# Altium schematic sheet Smart Smoke Detector.SchDoc
size A3; SheetNumber: 1; SheetTotal: 2
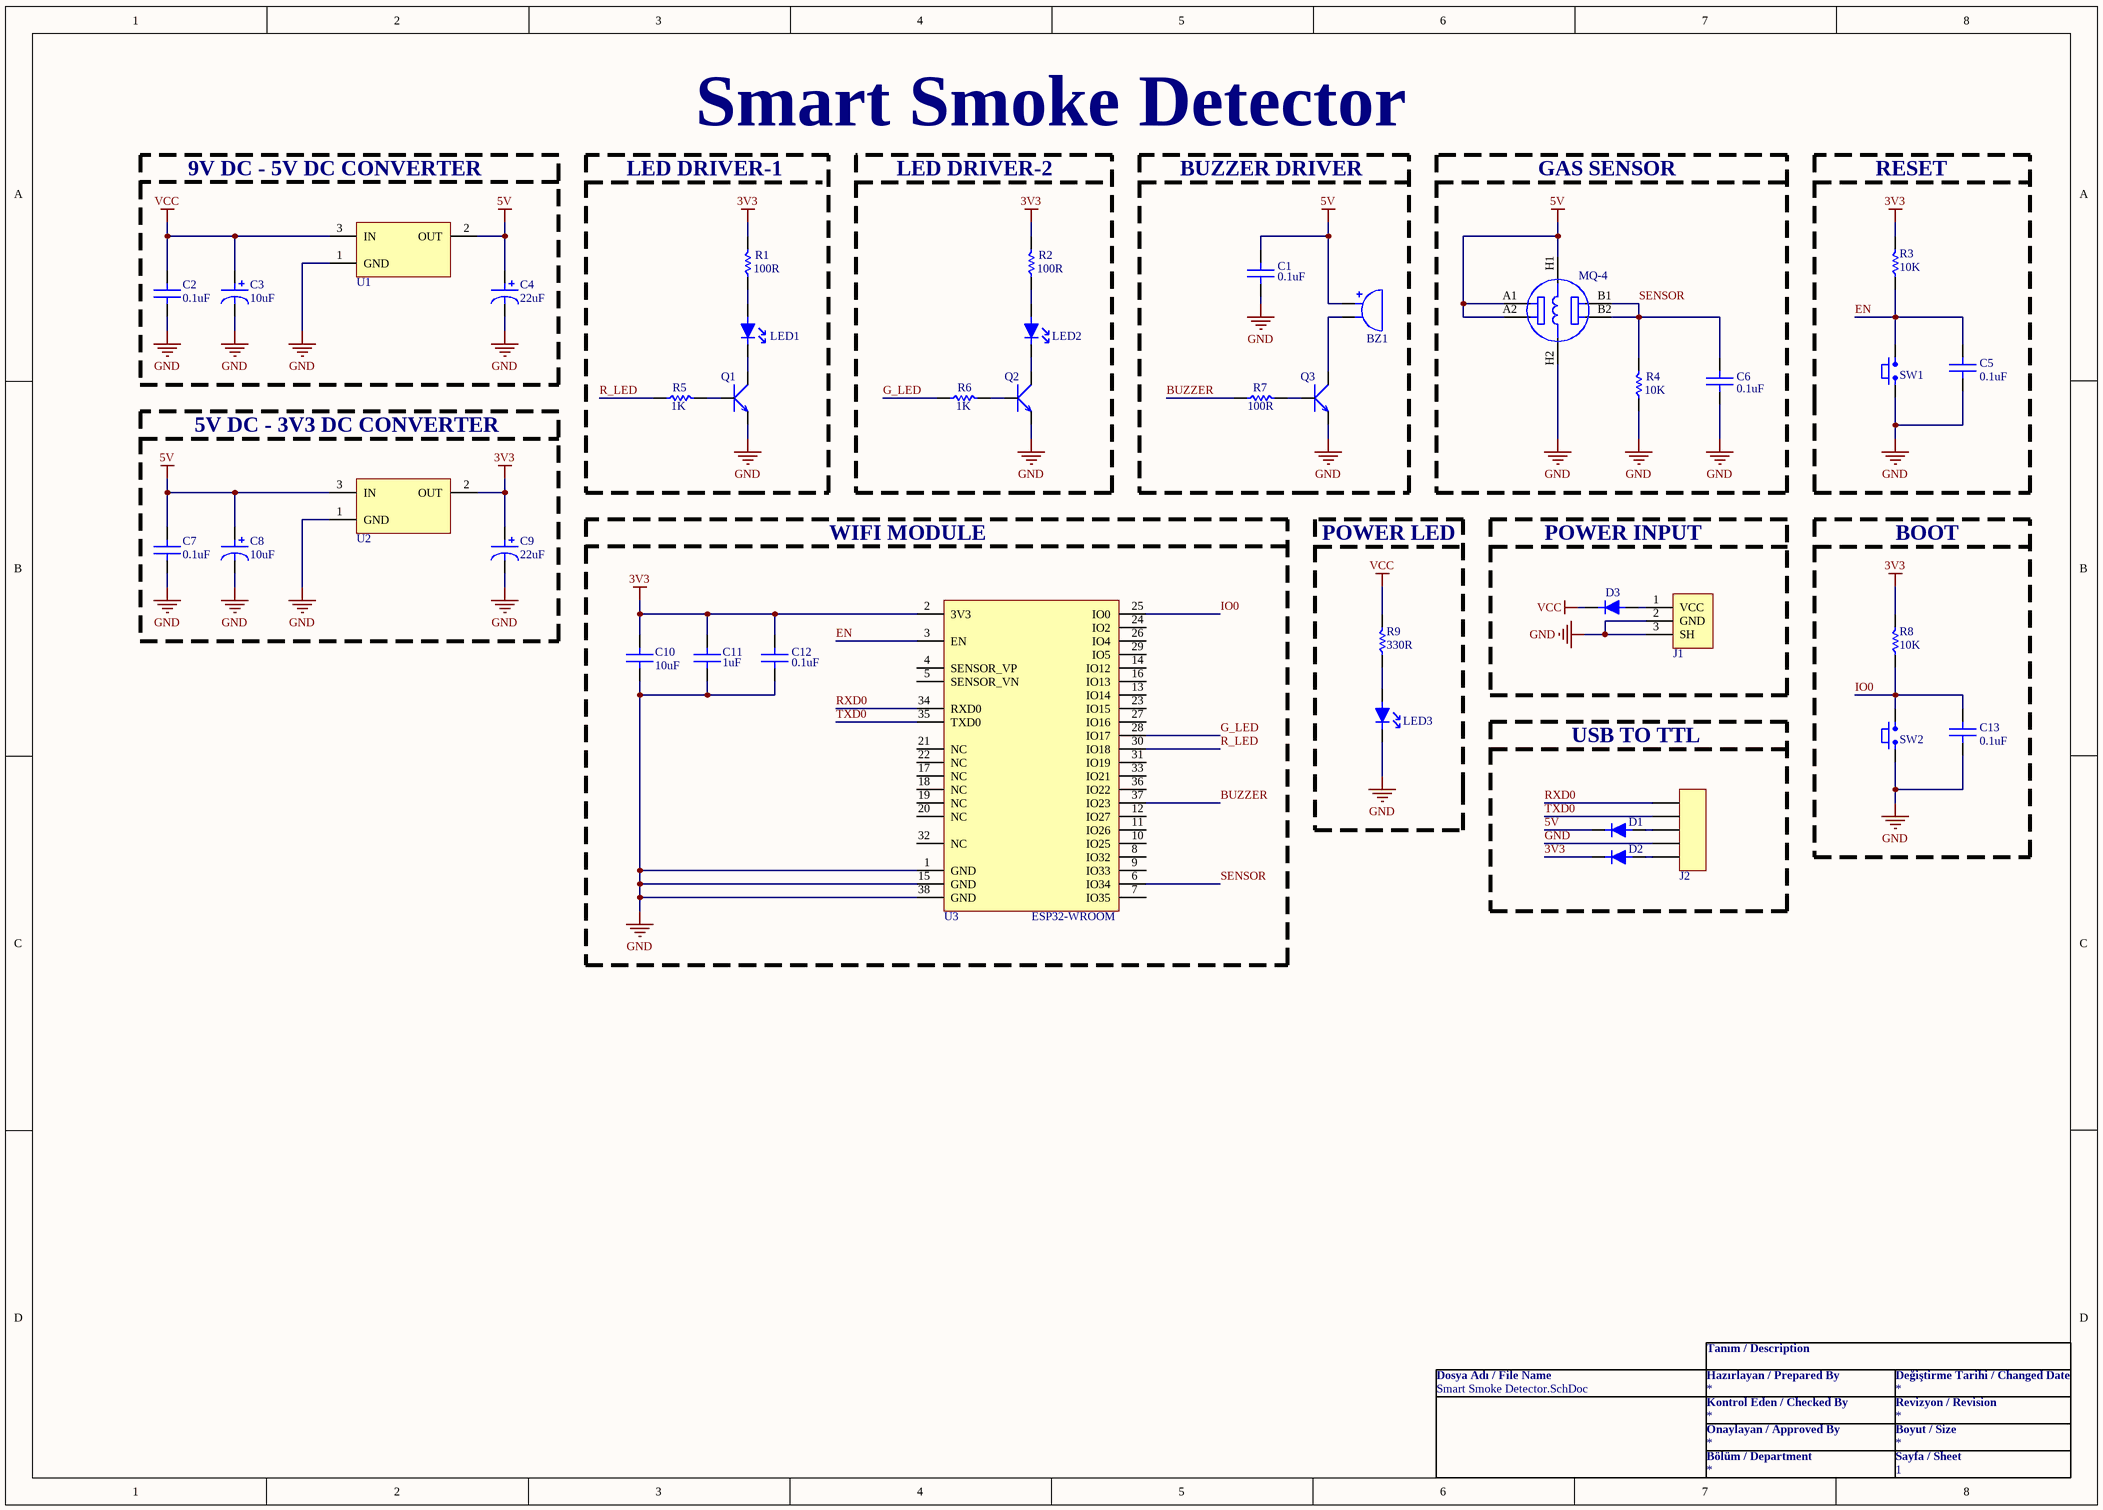
[diagram p0: Smart Smoke Detector.SchDoc]

## Parts
BZ1  AI-1223-TWT-3V-2-R  [BUZZER]  (value not drawn)
C1  value 0.1uF  [CAP 0805]  (hidden comment: CC0805KRX7R9BB104)
C2  value 0.1uF  [CAP 0805]  (hidden comment: CC0805KRX7R9BB104)
C3  value 10uF  [CAP ALUM 10UF]  (hidden comment: 875105359001)
C4  value 22uF  [CAP ALUM 22UF]  (hidden comment: A766EB226M1DLAE060)
C5  value 0.1uF  [CAP 0805]  (hidden comment: CC0805KRX7R9BB104)
C6  value 0.1uF  [CAP 0805]  (hidden comment: CC0805KRX7R9BB104)
C7  value 0.1uF  [CAP 0805]  (hidden comment: CC0805KRX7R9BB104)
C8  value 10uF  [CAP ALUM 10UF]  (hidden comment: 875105359001)
C9  value 22uF  [CAP ALUM 22UF]  (hidden comment: A766EB226M1DLAE060)
C10  value 10uF  [CAP 0805]  (hidden comment: CC0805KKX5R8BB106)
C11  value 1uF  [CAP 0805]  (hidden comment: CC0805KKX7R9BB105)
C12  value 0.1uF  [CAP 0805]  (hidden comment: CC0805KRX7R9BB104)
C13  value 0.1uF  [CAP 0805]  (hidden comment: CC0805KRX7R9BB104)
D1  1N5819W  [SOD-123F]  (value not drawn)
D2  1N5819W  [SOD-123F]  (value not drawn)
D3  1N5819W  [SOD-123F]  (value not drawn)
GAS1  value MQ-4  [MQ-4]  (hidden comment: SEN-09404)
J1  PJ-036BH-SMT-TR  [POWER JACK]  (value not drawn)
J2  SMH-105-02-L-S  [SMD HEADER]  (value not drawn)
LED1  151031SS06000  [RED LED]  (value not drawn)
LED2  151031VS06000  [GREEN LED]  (value not drawn)
LED3  151031VS06000  [GREEN LED]  (value not drawn)
Q1  MMBT3904-7-F  [SOT-23-3]  (value not drawn)
Q2  MMBT3904-7-F  [SOT-23-3]  (value not drawn)
Q3  MMBT3904-7-F  [SOT-23-3]  (value not drawn)
R1  value 100R  [RES 0805]  (hidden comment: RMCF0805FT100R)
R2  value 100R  [RES 0805]  (hidden comment: RMCF0805FT100R)
R3  value 10K  [RES 0805]  (hidden comment: ERJ-6GEYJ103V)
R4  value 10K  [RES 0805]  (hidden comment: ERJ-6GEYJ103V)
R5  value 1K  [RES 0805]  (hidden comment: RC0805FR-071KL)
R6  value 1K  [RES 0805]  (hidden comment: RC0805FR-071KL)
R7  value 100R  [RES 0805]  (hidden comment: RMCF0805FT100R)
R8  value 10K  [RES 0805]  (hidden comment: ERJ-6GEYJ103V)
R9  value 330R  [RES 0805]  (hidden comment: RC0805FR-07330RL)
SW1  PTS636 SK25F SMTR LFS  [TACTILE SWITCH]  (value not drawn)
SW2  PTS636 SK25F SMTR LFS  [TACTILE SWITCH]  (value not drawn)
U1  AMS1117-5.0  [SOT-223]  (value not drawn)
U2  AMS1117-3.3  [SOT-223]  (value not drawn)
U3  value ESP32-WROOM  [ESP32]  (hidden comment: ESP32-WROOM-32E-H4)

## Blocks framed on the sheet
LED DRIVER-1: LED1 Q1 R1 R5
LED DRIVER-2: LED2 Q2 R2 R6
BUZZER DRIVER: BZ1 C1 Q3 R7
GAS SENSOR: C6 GAS1 R4
RESET: C5 R3 SW1
5V DC - 3V3 DC CONVERTER: C7-C9 U2
POWER LED: LED3 R9
POWER INPUT: D3 J1
BOOT: C13 R8 SW2
USB TO TTL: D1 D2 J2

## Nets
3V3: C9.1 C10.2 C11.1 C12.1 D2.2 R1.2 R2.2 R3.2 R8.2 U2.2(OUT) U3.2(3V3)
5V: BZ1.1 C1.2 C4.1 C7.2 C8.1 D1.2 GAS1.A1 GAS1.A2 GAS1.H1 U1.2(OUT) U2.3(IN)
GND: C1.1 C2.1 C3.2 C4.2 C5.1 C6.1 C7.1 C8.2 C9.2 C10.1 C11.2 C12.2 C13.1 GAS1.H2 J1.2(GND) J1.3(SH) J2.4 LED3.2 Q1.2 Q2.2 Q3.2 R4.1 SW1.1 SW2.1 U1.1(GND) U2.1(GND) U3.1(GND) U3.15(GND) U3.38(GND)
VCC: C2.2 C3.1 D3.2 R9.2 U1.3(IN)
BUZZER: R7.1 U3.37(IO23)
EN: C5.2 R3.1 SW1.2 U3.3(EN)
G_LED: R6.1 U3.28(IO17)
IO0: C13.2 R8.1 SW2.2 U3.25(IO0)
R_LED: R5.1 U3.30(IO18)
RXD0: J2.1 U3.34(RXD0)
SENSOR: C6.2 GAS1.B1 GAS1.B2 R4.2 U3.6(IO34)
TXD0: J2.2 U3.35(TXD0)
NetBZ1_2: BZ1.2 Q3.3
NetD1_1: D1.1 J2.3
NetD2_1: D2.1 J2.5
NetD3_1: D3.1 J1.1(VCC)
NetLED1_1: LED1.1 R1.1
NetLED1_2: LED1.2 Q1.3
NetLED2_1: LED2.1 R2.1
NetLED2_2: LED2.2 Q2.3
NetLED3_1: LED3.1 R9.1
NetQ1_1: Q1.1 R5.2
NetQ2_1: Q2.1 R6.2
NetQ3_1: Q3.1 R7.2

Not connected (* = marked no-connect by the designer): U3 4(SENSOR_VP) 5(SENSOR_VN) 7(IO35) 8(IO32) 9(IO33) 10(IO25) 11(IO26) 12(IO27) 13(IO14) 14(IO12) 16(IO13) 17(NC) 18(NC) 19(NC) 20(NC) 21(NC) 22(NC) 23(IO15) 24(IO2) 26(IO4) 27(IO16) 29(IO5) 31(IO19) 32(NC) 33(IO21) 36(IO22)

## Notes on the sheet
- Smart Smoke Detector
- 9V DC - 5V DC CONVERTER
- WIFI MODULE
- Dosya Adı / File Name
- Hazırlayan / Prepared By
- Tanım / Description
- Değiştirme Tarihi / Changed Date
- Bölüm / Department
- Onaylayan / Approved By
- Kontrol Eden / Checked By
- Boyut / Size
- Sayfa / Sheet
- Revizyon / Revision

## Library data of the parts
BZ1 = BUZZER TH: BUZZER MAGNETIC 3V 12MM TH
C1 C2 C5-C7 C12 C13 = CAP CER 0.1UF 0805 SMD: CAP CER 0.1UF 50V X7R 0805
C3 C8 = CAP ALUM 10UF SMD: CAP ALUM 10UF 20% 16V SMD
C4 C9 = CAP ALUM 22UF SMD: CAP ALUM 22UF 20% 20V SMD
C10 = CAP CER 10UF 0805 SMD: CAP CER 10UF 25V X5R 0805
C11 = CAP CER 1UF 0805 SMD: CAP CER 1UF 50V X7R 0805
D1-D3 = SCHOTTKY DIODE SMD: DIODE SCHOTTKY 40V 1A SOD-123F
GAS1 = MQ-4 SENSOR: SENSOR METHANE 2.5V-4 V OUTPUT
J1 = POWER JACK SMD: PWR JACK 2.5X5.5MM SOLDER
J2 = HEADER 5POS SMD: FEMALE HEADER 5POS 2.54MM
LED1 = LED RED TH: LED RED 3MM ROUND T/H
LED2 LED3 = LED GREEN TH: LED GREEN 3MM ROUND T/H
Q1-Q3 = NPN TRANSISTOR SMD: TRANS NPN 40V 0.2A SOT23-3
R1 R2 R7 = RES 100 OHM 0805 SMD: RES 100 OHM 1% 1/8W 0805
R3 R8 = RES 10K OHM 0805 SMD: RES 10K OHM 5% 1/8W 0805
R4 = RES 10K OHM 0805 SMD: RES SMD 10K OHM 5% 1/8W 0805
R5 R6 = RES 1K OHM 0805 SMD: RES 1K OHM 1% 1/8W 0805
R9 = RES 330 OHM 0805 SMD: RES 330 OHM 1% 1/8W 0805
SW1 SW2 = TACTILE SWITCH SMD: SWITCH TACTILE 0.05A 12V
U1 = LDO REG 5V 1A SMD: IC LDO REG 5V 1A SOT223
U2 = LDO REG 3V3 1A SMD: IC LDO REG 3.3V 1A SOT223
U3 = ESP32-WROOM-32E: RF TXRX MOD BT WIFI TH SMD